# EAGLE design led_uhr (EAGLE 9.6.2)
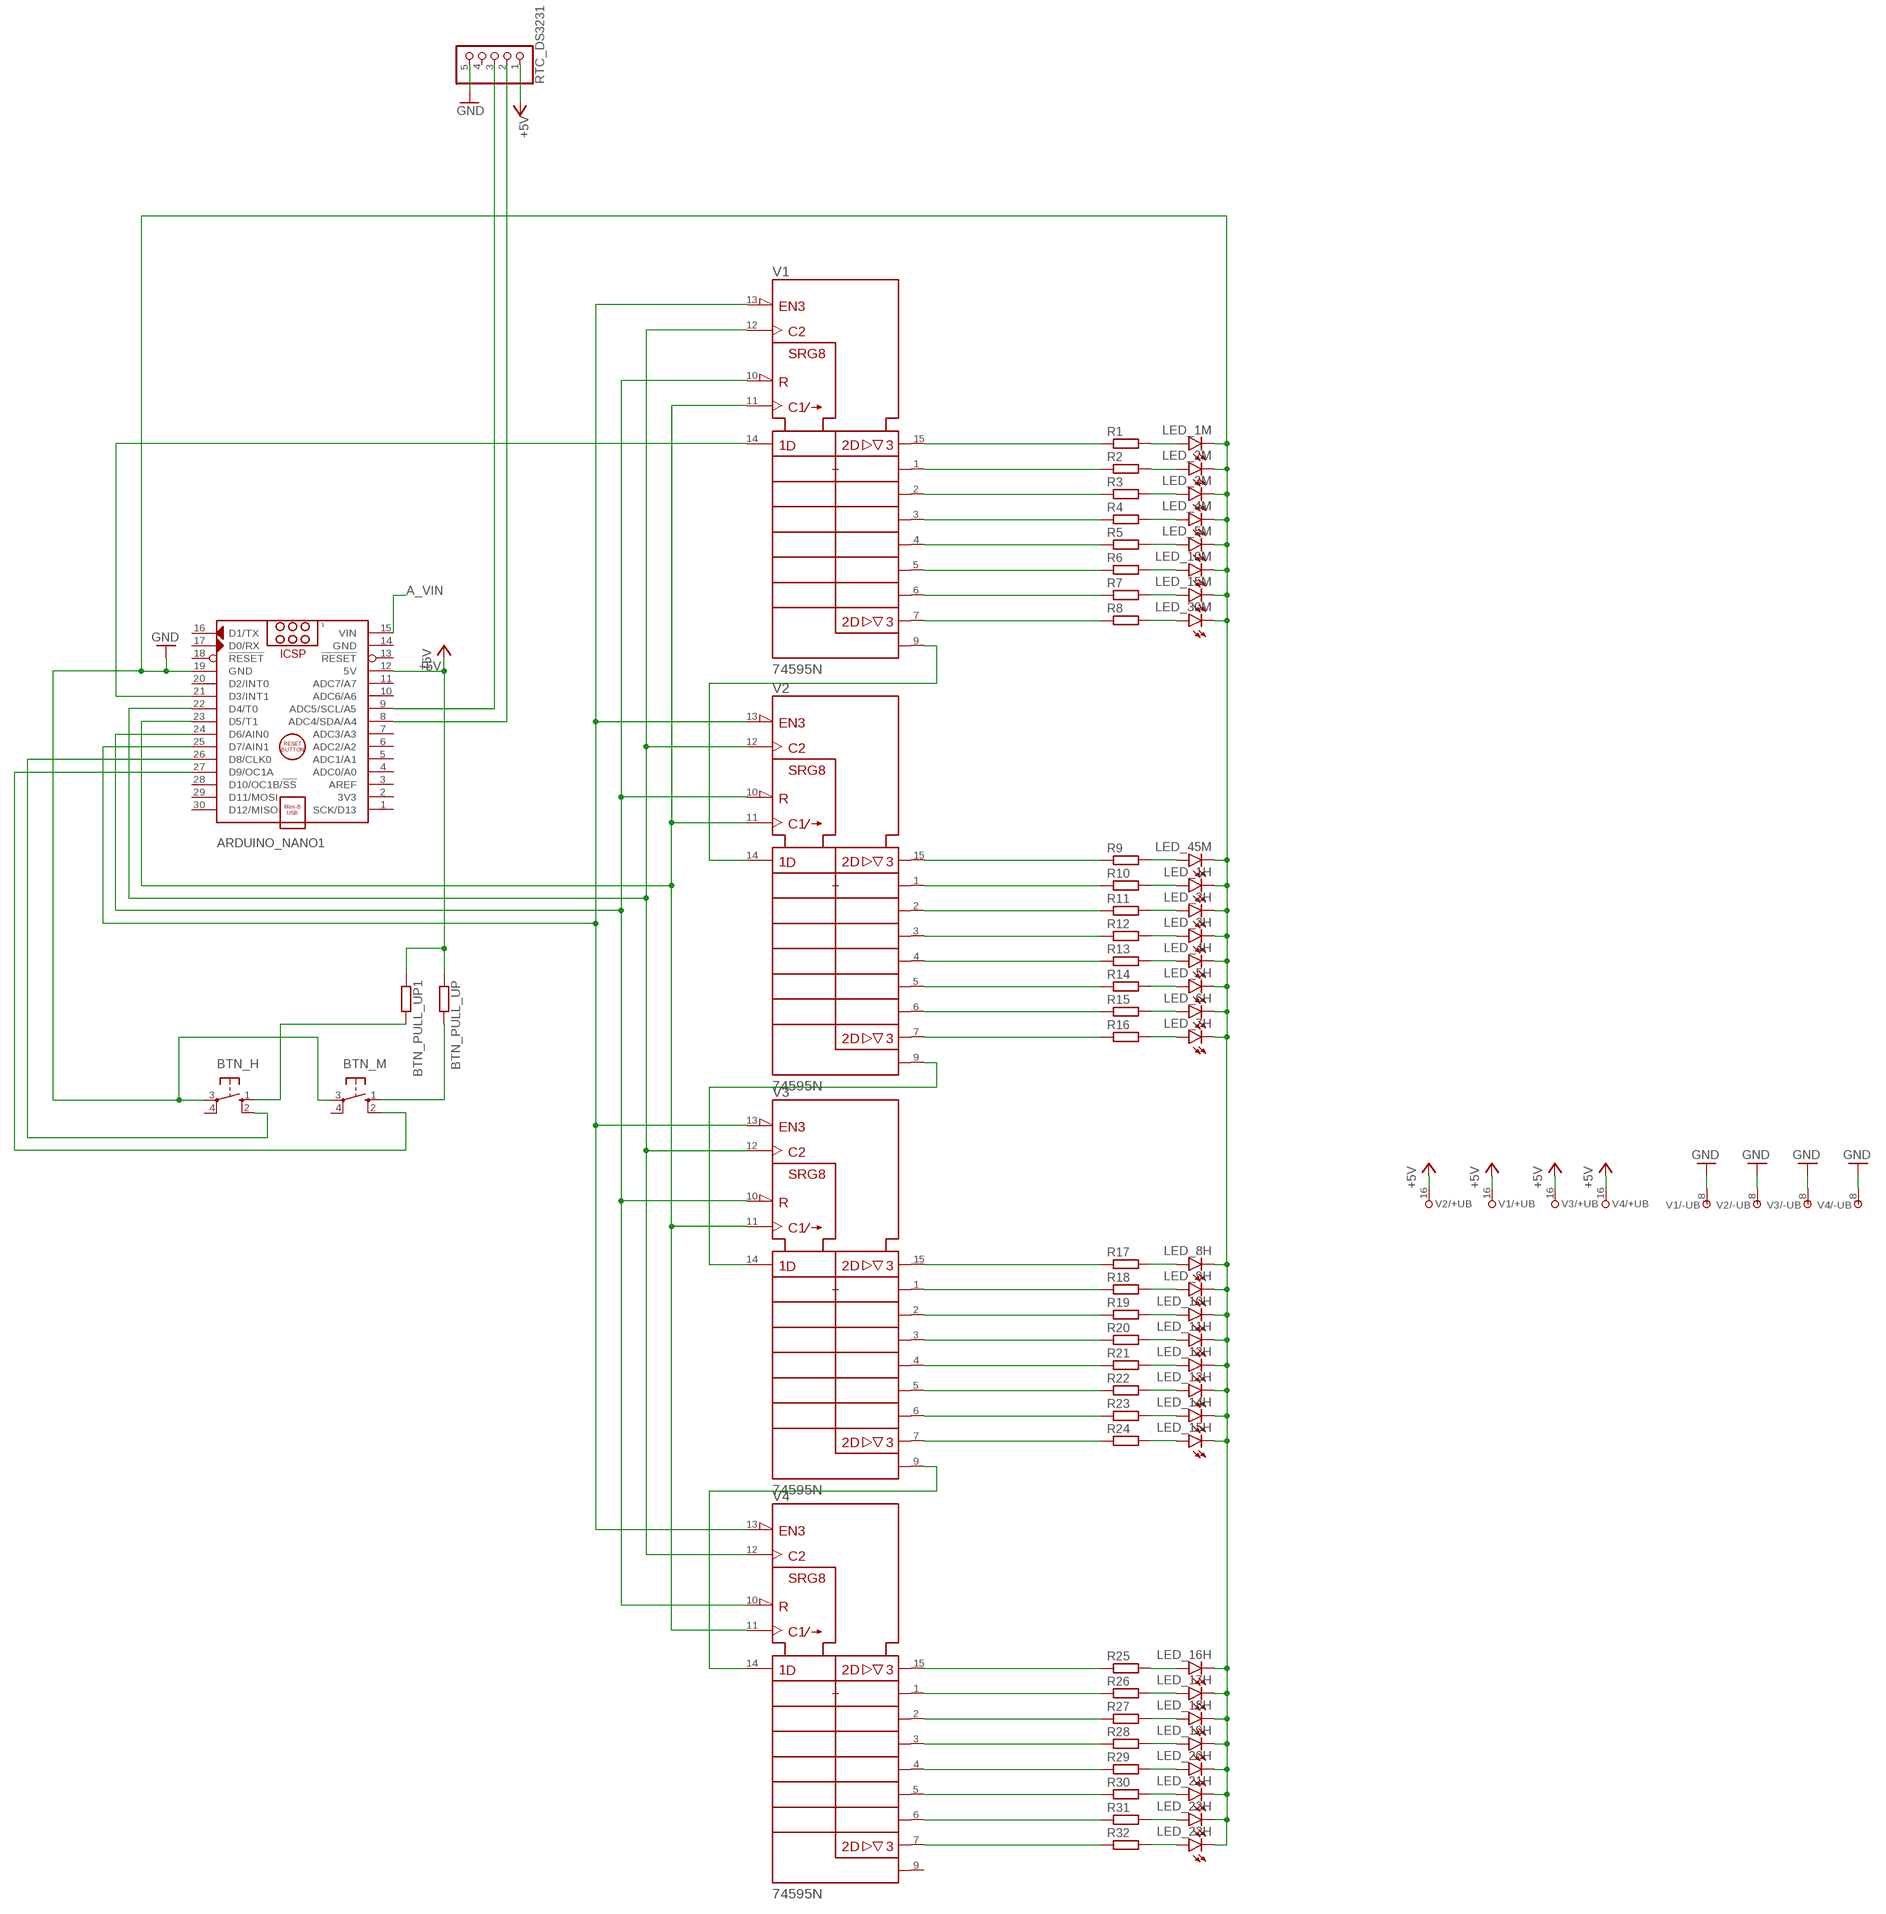
[diagram p0: schematic, sheet 1]

## Parts
ARDUINO_NANO1  ARDUINO_NANO  [ARDUINO_NANO]
BTN_H  40-XX  [B3F-40XX]
BTN_M  40-XX  [B3F-40XX]
BTN_PULL_UP  R-EU_0207/10  [0207/10]
BTN_PULL_UP1  R-EU_0207/10  [0207/10]
LED_1H  LED5MM  [LED5MM]
LED_1M  LED5MM  [LED5MM]
LED_2H  LED5MM  [LED5MM]
LED_2M  LED5MM  [LED5MM]
LED_3H  LED5MM  [LED5MM]
LED_3M  LED5MM  [LED5MM]
LED_4H  LED5MM  [LED5MM]
LED_4M  LED5MM  [LED5MM]
LED_5H  LED5MM  [LED5MM]
LED_5M  LED5MM  [LED5MM]
LED_6H  LED5MM  [LED5MM]
LED_7H  LED5MM  [LED5MM]
LED_8H  LED5MM  [LED5MM]
LED_9H  LED5MM  [LED5MM]
LED_10H  LED5MM  [LED5MM]
LED_10M  LED5MM  [LED5MM]
LED_11H  LED5MM  [LED5MM]
LED_12H  LED5MM  [LED5MM]
LED_13H  LED5MM  [LED5MM]
LED_14H  LED5MM  [LED5MM]
LED_15H  LED5MM  [LED5MM]
LED_15M  LED5MM  [LED5MM]
LED_16H  LED5MM  [LED5MM]
LED_17H  LED5MM  [LED5MM]
LED_18H  LED5MM  [LED5MM]
LED_19H  LED5MM  [LED5MM]
LED_20H  LED5MM  [LED5MM]
LED_21H  LED5MM  [LED5MM]
LED_22H  LED5MM  [LED5MM]
LED_23H  LED5MM  [LED5MM]
LED_30M  LED5MM  [LED5MM]
LED_45M  LED5MM  [LED5MM]
R1  R-EU_0207/10  [0207/10]
R2  R-EU_0207/10  [0207/10]
R3  R-EU_0207/10  [0207/10]
R4  R-EU_0207/10  [0207/10]
R5  R-EU_0207/10  [0207/10]
R6  R-EU_0207/10  [0207/10]
R7  R-EU_0207/10  [0207/10]
R8  R-EU_0207/10  [0207/10]
R9  R-EU_0207/10  [0207/10]
R10  R-EU_0207/10  [0207/10]
R11  R-EU_0207/10  [0207/10]
R12  R-EU_0207/10  [0207/10]
R13  R-EU_0207/10  [0207/10]
R14  R-EU_0207/10  [0207/10]
R15  R-EU_0207/10  [0207/10]
R16  R-EU_0207/10  [0207/10]
R17  R-EU_0207/10  [0207/10]
R18  R-EU_0207/10  [0207/10]
R19  R-EU_0207/10  [0207/10]
R20  R-EU_0207/10  [0207/10]
R21  R-EU_0207/10  [0207/10]
R22  R-EU_0207/10  [0207/10]
R23  R-EU_0207/10  [0207/10]
R24  R-EU_0207/10  [0207/10]
R25  R-EU_0207/10  [0207/10]
R26  R-EU_0207/10  [0207/10]
R27  R-EU_0207/10  [0207/10]
R28  R-EU_0207/10  [0207/10]
R29  R-EU_0207/10  [0207/10]
R30  R-EU_0207/10  [0207/10]
R31  R-EU_0207/10  [0207/10]
R32  R-EU_0207/10  [0207/10]
RTC_DS3231  PINHD-1X5  [1X05]
V1  74595N  [DIL16]
V2  74595N  [DIL16]
V3  74595N  [DIL16]
V4  74595N  [DIL16]

## Nets
+5V: ARDUINO_NANO1.12(5V) BTN_PULL_UP1.1 BTN_PULL_UP.1 RTC_DS3231.1 V1.16(+UB) V2.16(+UB) V3.16(+UB) V4.16(+UB)
A_VIN: ARDUINO_NANO1.15(VIN)
GND: ARDUINO_NANO1.19(GND) BTN_H.3(P) BTN_M.3(P) LED_1H.K(C) LED_1M.K(C) LED_2H.K(C) LED_2M.K(C) LED_3H.K(C) LED_3M.K(C) LED_4H.K(C) LED_4M.K(C) LED_5H.K(C) LED_5M.K(C) LED_6H.K(C) LED_7H.K(C) LED_8H.K(C) LED_9H.K(C) LED_10H.K(C) LED_10M.K(C) LED_11H.K(C) LED_12H.K(C) LED_13H.K(C) LED_14H.K(C) LED_15H.K(C) LED_15M.K(C) LED_16H.K(C) LED_17H.K(C) LED_18H.K(C) LED_19H.K(C) LED_20H.K(C) LED_21H.K(C) LED_22H.K(C) LED_23H.K(C) LED_30M.K(C) LED_45M.K(C) RTC_DS3231.5 V1.8(-UB) V2.8(-UB) V3.8(-UB) V4.8(-UB)
N$2: R1.1 V1.15(QA)
N$3: R2.1 V1.1(QB)
N$4: R3.1 V1.2(QC)
N$5: R4.1 V1.3(QD)
N$6: R5.1 V1.4(QE)
N$7: R6.1 V1.5(QF)
N$8: R7.1 V1.6(QG)
N$9: R8.1 V1.7(QH)
N$10: R10.1 V2.1(QB)
N$11: R9.1 V2.15(QA)
N$12: R11.1 V2.2(QC)
N$13: R12.1 V2.3(QD)
N$14: R13.1 V2.4(QE)
N$15: R14.1 V2.5(QF)
N$16: R15.1 V2.6(QG)
N$17: R16.1 V2.7(QH)
N$18: R17.1 V3.15(QA)
N$19: R18.1 V3.1(QB)
N$20: R19.1 V3.2(QC)
N$21: R20.1 V3.3(QD)
N$22: R21.1 V3.4(QE)
N$23: R22.1 V3.5(QF)
N$24: R23.1 V3.6(QG)
N$25: R24.1 V3.7(QH)
N$26: R25.1 V4.15(QA)
N$27: R26.1 V4.1(QB)
N$28: R27.1 V4.2(QC)
N$29: R28.1 V4.3(QD)
N$30: R29.1 V4.4(QE)
N$31: R30.1 V4.5(QF)
N$32: R31.1 V4.6(QG)
N$33: R32.1 V4.7(QH)
N$34: V1.9(QH*) V2.14(SER)
N$35: V2.9(QH*) V3.14(SER)
N$36: V3.9(QH*) V4.14(SER)
N$37: LED_1M.A R1.2
N$38: LED_2M.A R2.2
N$39: LED_3M.A R3.2
N$40: LED_4M.A R4.2
N$41: LED_5M.A R5.2
N$42: LED_10M.A R6.2
N$43: LED_15M.A R7.2
N$44: LED_30M.A R8.2
N$45: LED_45M.A R9.2
N$46: LED_1H.A R10.2
N$47: LED_2H.A R11.2
N$48: LED_3H.A R12.2
N$49: LED_4H.A R13.2
N$50: LED_5H.A R14.2
N$51: LED_6H.A R15.2
N$52: LED_7H.A R16.2
N$53: LED_8H.A R17.2
N$54: LED_9H.A R18.2
N$55: LED_10H.A R19.2
N$56: LED_11H.A R20.2
N$57: LED_12H.A R21.2
N$58: LED_13H.A R22.2
N$59: LED_14H.A R23.2
N$60: LED_15H.A R24.2
N$61: LED_16H.A R25.2
N$62: LED_17H.A R26.2
N$63: LED_18H.A R27.2
N$64: LED_19H.A R28.2
N$65: LED_20H.A R29.2
N$66: LED_21H.A R30.2
N$67: LED_22H.A R31.2
N$68: LED_23H.A R32.2
N$69: ARDUINO_NANO1.23(D5/T1) V1.11(SRCK) V2.11(SRCK) V3.11(SRCK) V4.11(SRCK)
N$70: ARDUINO_NANO1.24(D6/AIN0) V1.10(!SRCLR) V2.10(!SRCLR) V3.10(!SRCLR) V4.10(!SRCLR)
N$71: ARDUINO_NANO1.21(D3/INT1) V1.14(SER)
N$72: ARDUINO_NANO1.22(D4/T0) V1.12(RCK) V2.12(RCK) V3.12(RCK) V4.12(RCK)
N$73: ARDUINO_NANO1.25(D7/AIN1) V1.13(!G) V2.13(!G) V3.13(!G) V4.13(!G)
N$74: BTN_M.1(S) BTN_PULL_UP.2
N$75: ARDUINO_NANO1.27(D9/OC1A) BTN_M.2(S1)
N$77: ARDUINO_NANO1.9(ADC5/SCL/A5) RTC_DS3231.3
N$78: ARDUINO_NANO1.8(ADC4/SDA/A4) RTC_DS3231.2
N$80: ARDUINO_NANO1.26(D8/CLK0) BTN_H.2(S1)
N$81: BTN_H.1(S) BTN_PULL_UP1.2
Unconnected: ARDUINO_NANO1.1(SCK/D13) ARDUINO_NANO1.2(3V3) ARDUINO_NANO1.3(AREF) ARDUINO_NANO1.4(ADC0/A0) ARDUINO_NANO1.5(ADC1/A1) ARDUINO_NANO1.6(ADC2/A2) ARDUINO_NANO1.7(ADC3/A3) ARDUINO_NANO1.10(ADC6/A6) ARDUINO_NANO1.11(ADC7/A7) ARDUINO_NANO1.13(!RESET) ARDUINO_NANO1.16(D1/TX) ARDUINO_NANO1.17(D0/RX) ARDUINO_NANO1.18(!RESET) ARDUINO_NANO1.20(D2/INT0) ARDUINO_NANO1.28(D10/OC1B/!SS) ARDUINO_NANO1.29(D11/MOSI) ARDUINO_NANO1.30(D12/MISO) BTN_H.4(P1) BTN_M.4(P1) RTC_DS3231.4 V4.9(QH*)

## Power pins joined to a net without a drawn wire
GND: ARDUINO_NANO1.14(GND)

## Library data of the parts
ARDUINO_NANO1 = ArduinoNanoV30:ARDUINO_NANO: Arduino Nano V3.0 Module Overview: The Arduino Nano is a small, complete, and breadboard-friendly board based on the ATmega328 (Arduino Nano 3.x) or ATmega168 (Arduino Nano 2.x). It has more or less the same functionality of the Arduino Duemilanove, but in a different package. It lacks only a DC power jack, and works with a Mini-B USB cable instead of a standard one. The Nano was designed and is being produced by Gravitech <http://www.gravitech.us/arna30wiatp.html>. General specifications: Item Value Microcontroller Atmel ATmega168 or ATmega328 Operating Voltage (logic level) 5 V Input Voltage (recommended) 7-12 V Input Voltage (limits) 6-20 V Digital I/O Pins 14 (of which 6 provide PWM output) Analog Input Pins 8 DC Current per I/O Pin 40 mA Flash Memory 16 KB (ATmega168) or 32 KB (ATmega328) of which 2 KB used by bootloader SRAM 1 KB (ATmega168) or 2 KB (ATmega328) EEPROM 512 bytes (ATmega168) or 1 KB (ATmega328) Clock Speed 16 MHz Dimensions (Inches) 0.73" x 1.70" Dimensions (mm) 18mm x 45mm Overall height About 9 mm (not including pins) Weigth 5 g Power: The Arduino Nano can be powered via the Mini-B USB connection, 6-20V unregulated external power supply (pin 30), or 5V regulated external power supply (pin 27). The power source is automatically selected to the highest voltage source. Memory: The ATmega168 has 16 KB of flash memory for storing code (of which 2 KB is used for the bootloader); the ATmega328 has 32 KB, (also with 2 KB used for the bootloader). The ATmega168 has 1 KB of SRAM and 512 bytes of EEPROM (which can be read and written with the EEPROM library); the ATmega328 has 2 KB of SRAM and 1 KB of EEPROM. Input and Output: Each of the 14 digital pins on the Nano can be used as an input or output, using pinMode(), digitalWrite(), and digitalRead() functions. They operate at 5 volts. Each pin can provide or receive a maximum of 40 mA and has an internal pull-up resistor (disconnected by default) of 20-50 kOhms. In addition, some pins have specialized functions. Visit Arduino - ArduinoBoardNano <https://www.arduino.cc/en/Main/ArduinoBoardNano>
BTN_H BTN_M = switch-omron:40-XX: OMRON SWITCH; MF: OMRON COMPONENTS USA; MPN: B3F-4000; OC_FARNELL: 176434; OC_NEWARK: 36K3105
BTN_PULL_UP BTN_PULL_UP1 R1-R32 = rcl:R-EU_: RESISTOR, European symbol; SPICEPREFIX: R
LED_1H LED_1M LED_2H LED_2M LED_3H LED_3M LED_4H LED_4M LED_5H LED_5M LED_6H LED_7H LED_8H LED_9H LED_10H LED_10M LED_11H LED_12H LED_13H LED_14H LED_15H LED_15M LED_16H LED_17H LED_18H LED_19H LED_20H LED_21H LED_22H LED_23H LED_30M LED_45M = led:LED: LED OSRAM: - CHIPLED LG R971, LG N971, LY N971, LG Q971, LY Q971, LO R971, LY R971 LH N974, LH R974 LS Q976, LO Q976, LY Q976 LO Q996 - Hyper CHIPLED LW Q18S LB Q993, LB Q99A, LB R99A - SideLED LS A670, LO A670, LY A670, LG A670, LP A670 LB A673, LV A673, LT A673, LW A673 LH A674 LY A675 LS A676, LA A676, LO A676, LY A676, LW A676 LS A679, LY A679, LG A679 - Hyper Micro SIDELED® LS Y876, LA Y876, LO Y876, LY Y876 LT Y87S - SmartLED LW L88C, LW L88S LB L89C, LB L89S, LG L890 LS L89K, LO L89K, LY L89K LS L896, LA L896, LO L896, LY L896 - TOPLED LS T670, LO T670, LY T670, LG T670, LP T670 LSG T670, LSP T670, LSY T670, LOP T670, LYG T670 LG T671, LOG T671, LSG T671 LB T673, LV T673, LT T673, LW T673 LH T674 LS T676, LA T676, LO T676, LY T676, LB T676, LH T676, LSB T676, LW T676 LB T67C, LV T67C, LT T67C, LS T67K, LO T67K, LY T67K, LW E67C LS E67B, LA E67B, LO E67B, LY E67B, LB E67C, LV E67C, LT E67C LW T67C LS T679, LY T679, LG T679 LS T770, LO T770, LY T770, LG T770, LP T770 LB T773, LV T773, LT T773, LW T773 LH T774 LS E675, LA E675, LY E675, LS T675 LS T776, LA T776, LO T776, LY T776, LB T776 LHGB T686 LT T68C, LB T68C - Hyper Mini TOPLED® LB M676 - Mini TOPLED Santana® LG M470 LS M47K, LO M47K, LY M47K Source: http://www.osram.convergy.de LUXEON: - LUMILED® LXK2-PW12-R00, LXK2-PW12-S00, LXK2-PW14-U00, LXK2-PW14-V00 LXK2-PM12-R00, LXK2-PM12-S00, LXK2-PM14-U00 LXK2-PE12-Q00, LXK2-PE12-R00, LXK2-PE12-S00, LXK2-PE14-T00, LXK2-PE14-U00 LXK2-PB12-K00, LXK2-PB12-L00, LXK2-PB12-M00, LXK2-PB14-N00, LXK2-PB14-P00, LXK2-PB14-Q00 LXK2-PR12-L00, LXK2-PR12-M00, LXK2-PR14-Q00, LXK2-PR14-R00 LXK2-PD12-Q00, LXK2-PD12-R00, LXK2-PD12-S00 LXK2-PH12-R00, LXK2-PH12-S00 LXK2-PL12-P00, LXK2-PL12-Q00, LXK2-PL12-R00 Source: www.luxeon.com KINGBRIGHT: KA-3528ASYC Source: www.kingbright.com
RTC_DS3231 = pinhead:PINHD-1X5: PIN HEADER
V1-V4 = 74ttl-din:74*595: 8-bit SHIFT REGISTER, output latch

## Board
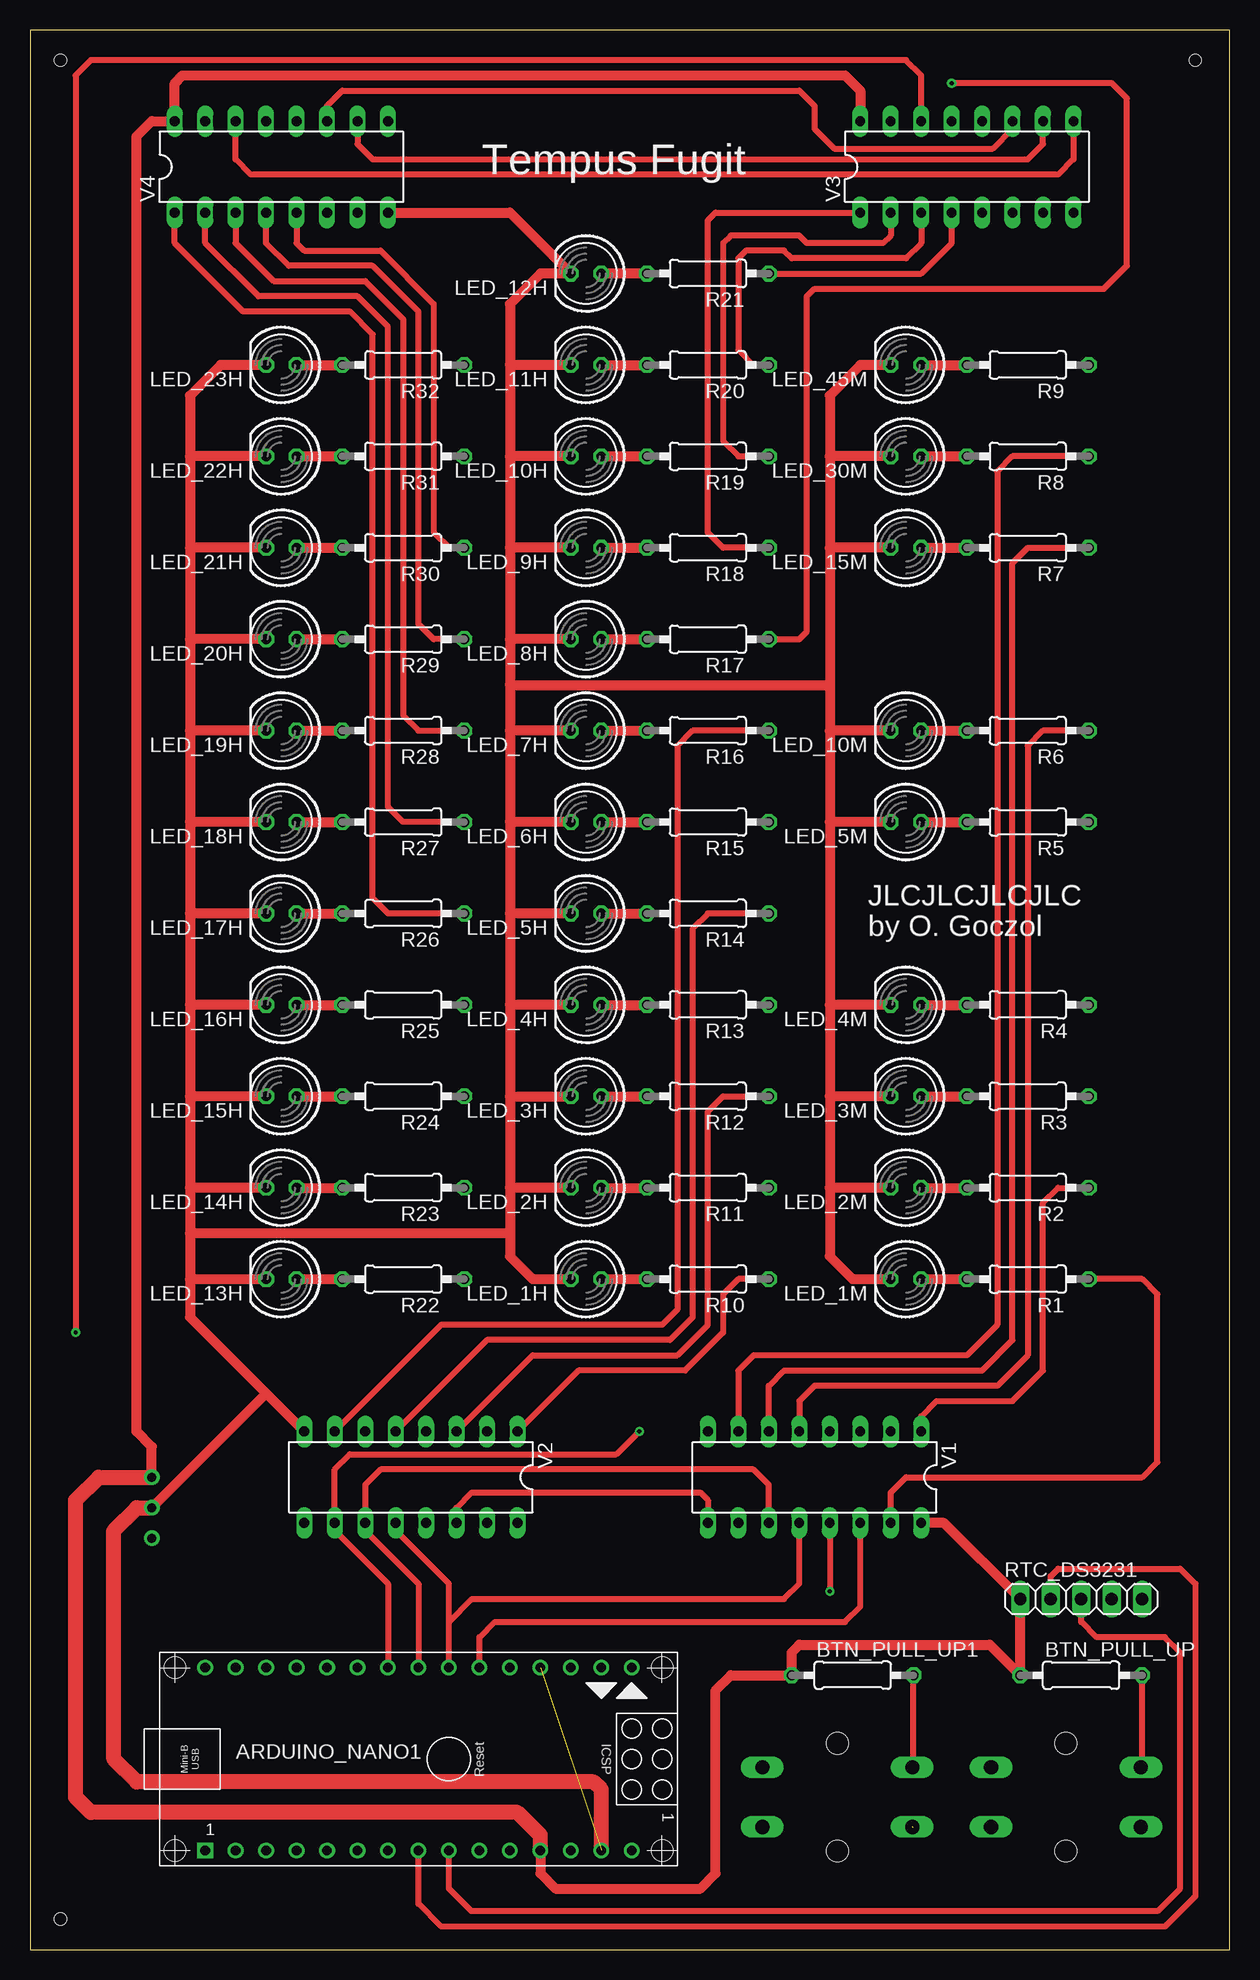
[diagram p1: board, top side]
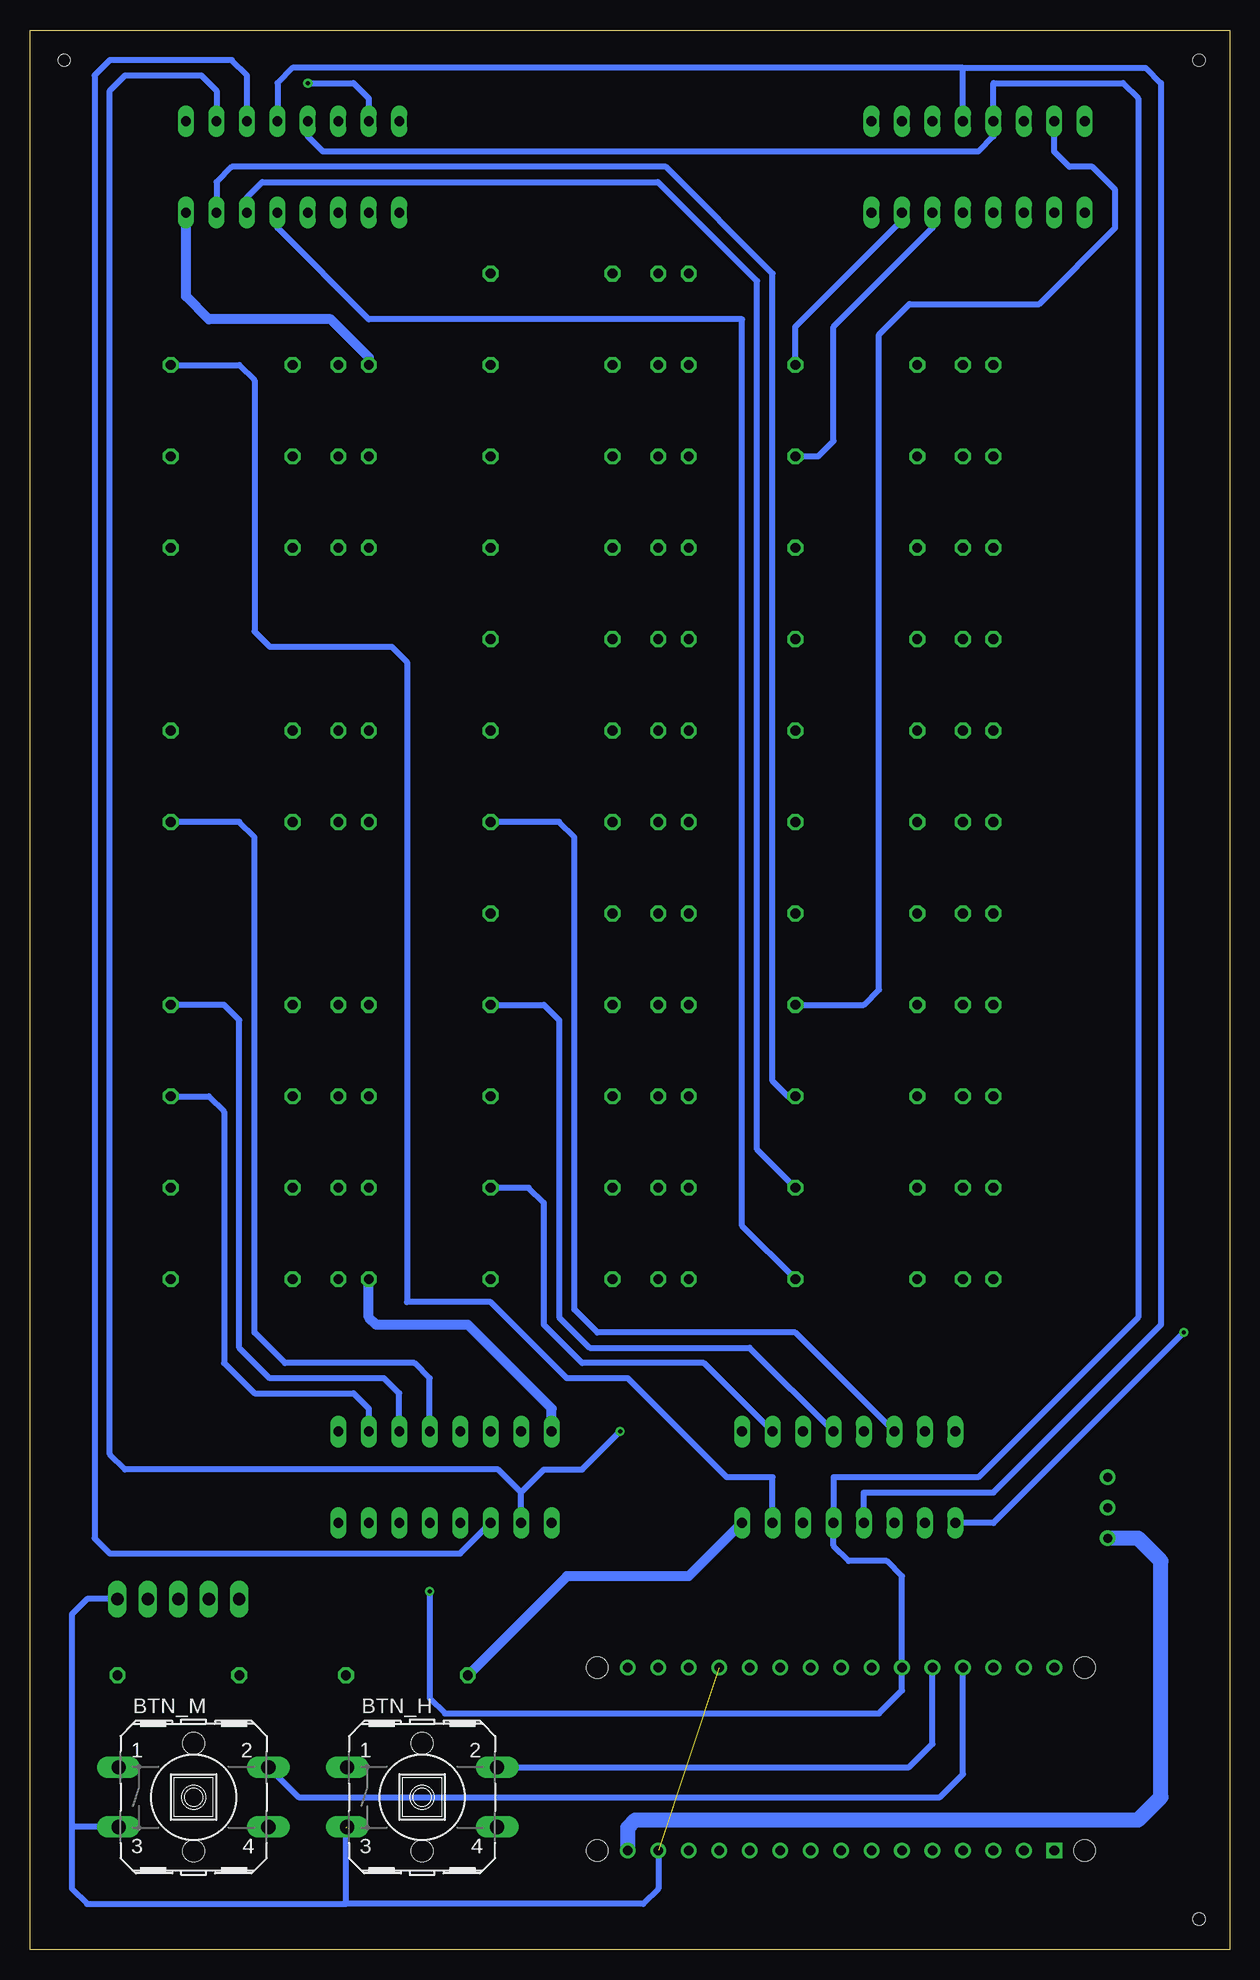
[diagram p2: board, bottom side, seen from below]

Size 100 x 160 mm. Coordinates in mm from the lower left corner, seen from the top.
Outline: 0,0 100,0 100,160 0,160 0,0
Copper layers (1*16): Top 0.035mm / dielectric 1.5mm / Bottom 0.035mm
Design rules "default": minimum track width 6mil, minimum drill 0.35mm, track to track 6mil, track to pad 6mil, pad to pad 6mil, via to via 6mil, smd to smd 6mil, copper to edge 40mil, drill to drill 6mil, minimum pad ring 10mil, minimum via ring 8mil, stop-mask expansion 4mil, vias tented up to drill 0mil, thermal gap 10mil
Holes 1 mm at 2.54,157.48 2.54,2.54 97.16,157.48

### Footprints (pad centres in the part's own frame; a part is rotated, then mirrored left to right if it is on the bottom)
ARDUINO_NANO = drill 0.8 square: 1 -20.32,-7.62 | drill 0.8: 2 -17.78,-7.62; 3 -15.24,-7.62; 4 -12.7,-7.62; 5 -10.16,-7.62; 6 -7.62,-7.62; 7 -5.08,-7.62; 8 -2.54,-7.62; 9 0,-7.62; 10 2.54,-7.62; 11 5.08,-7.62; 12 7.62,-7.62; 13 10.16,-7.62; 14 12.7,-7.62; 15 15.24,-7.62; 16 15.24,7.62; 17 12.7,7.62; 18 10.16,7.62; 19 7.62,7.62; 20 5.08,7.62; 21 2.54,7.62; 22 0,7.62; 23 -2.54,7.62; 24 -5.08,7.62; 25 -7.62,7.62; 26 -10.16,7.62; 27 -12.7,7.62; 28 -15.24,7.62; 29 -17.78,7.62; 30 -20.32,7.62 | hole 1.778: -22.86,-7.62; -22.86,7.62; 17.78,7.62; 17.78,-7.62
B3F-40XX = drill 1.194 long: 1 -6.248,2.489; 2 6.248,2.489; 3 -6.248,-2.489; 4 6.248,-2.489 | hole 1.803: 0,-4.496; 0,4.496
0207/10 = drill 0.813 octagon: 1 -5.08,0; 2 5.08,0
LED5MM = drill 0.813 octagon: A -1.27,0; K 1.27,0
1X05 = drill 1.016 long: 1 -5.08,0; 2 -2.54,0; 3 0,0; 4 2.54,0; 5 5.08,0
DIL16 = drill 0.813 long: 1 -8.89,-3.81; 2 -6.35,-3.81; 3 -3.81,-3.81; 4 -1.27,-3.81; 5 1.27,-3.81; 6 3.81,-3.81; 7 6.35,-3.81; 8 8.89,-3.81; 9 8.89,3.81; 10 6.35,3.81; 11 3.81,3.81; 12 1.27,3.81; 13 -1.27,3.81; 14 -3.81,3.81; 15 -6.35,3.81; 16 -8.89,3.81

### Placement (x,y rotation side)
ARDUINO_NANO1  34.92,15.88 0 top
BTN_H  67.31,12.7 0 bottom
BTN_M  86.36,12.7 0 bottom
BTN_PULL_UP  87.63,22.86 0 top
BTN_PULL_UP1  68.58,22.86 0 top
LED_1H  46.35,55.88 180 top
LED_1M  73.03,55.88 180 top
LED_2H  46.35,63.5 180 top
LED_2M  73.03,63.5 180 top
LED_3H  46.35,71.12 180 top
LED_3M  73.03,71.12 180 top
LED_4H  46.35,78.74 180 top
LED_4M  73.03,78.74 180 top
LED_5H  46.35,86.36 180 top
LED_5M  73.03,93.98 180 top
LED_6H  46.35,93.98 180 top
LED_7H  46.35,101.6 180 top
LED_8H  46.35,109.22 180 top
LED_9H  46.35,116.84 180 top
LED_10H  46.35,124.46 180 top
LED_10M  73.03,101.6 180 top
LED_11H  46.35,132.08 180 top
LED_12H  46.35,139.7 180 top
LED_13H  20.95,55.88 180 top
LED_14H  20.95,63.5 180 top
LED_15H  20.95,71.12 180 top
LED_15M  73.03,116.84 180 top
LED_16H  20.95,78.74 180 top
LED_17H  20.95,86.36 180 top
LED_18H  20.95,93.98 180 top
LED_19H  20.95,101.6 180 top
LED_20H  20.95,109.22 180 top
LED_21H  20.95,116.84 180 top
LED_22H  20.95,124.46 180 top
LED_23H  20.95,132.08 180 top
LED_30M  73.03,124.46 180 top
LED_45M  73.03,132.08 180 top
R1  83.19,55.88 180 top
R2  83.19,63.5 180 top
R3  83.19,71.12 180 top
R4  83.19,78.74 180 top
R5  83.19,93.98 180 top
R6  83.19,101.6 180 top
R7  83.19,116.84 180 top
R8  83.19,124.46 180 top
R9  83.19,132.08 180 top
R10  56.52,55.88 180 top
R11  56.52,63.5 180 top
R12  56.52,71.12 180 top
R13  56.52,78.74 180 top
R14  56.52,86.36 180 top
R15  56.52,93.98 180 top
R16  56.52,101.6 180 top
R17  56.52,109.22 180 top
R18  56.52,116.84 180 top
R19  56.52,124.46 180 top
R20  56.52,132.08 180 top
R21  56.52,139.7 180 top
R22  31.11,55.88 180 top
R23  31.11,63.5 180 top
R24  31.11,71.12 180 top
R25  31.11,78.74 180 top
R26  31.11,86.36 180 top
R27  31.11,93.98 180 top
R28  31.11,101.6 180 top
R29  31.11,109.22 180 top
R30  31.11,116.84 180 top
R31  31.11,124.46 180 top
R32  31.11,132.08 180 top
RTC_DS3231  87.63,29.21 0 top
V1  65.41,39.37 180 top
V2  31.75,39.37 180 top
V3  78.11,148.59 0 top
V4  20.95,148.59 0 top

### Tracks (layer width: path | path; a pad name or v marks a point on that pad's centre or on a via)
+5V  (via drill 0.75 pad 1.3)
  Top 0.813: V3.16 69.22,154.94 67.94,156.21 12.7,156.21 12.06,155.57 V4.16 10.16,152.4 8.89,151.13 8.89,43.18 10.16,41.91 v10.16,39.37 | ARDUINO_NANO1.12 42.55,6.35 43.81,5.08 55.88,5.08 57.15,6.35 57.15,21.59 58.42,22.86 BTN_PULL_UP1.1 63.5,24.77 64.14,25.4 80.01,25.4 BTN_PULL_UP.1 RTC_DS3231.1 76.2,35.56 V1.16
  Top 1.27: ARDUINO_NANO1.12 42.55,9.53 40.64,11.43 5.08,11.43 3.81,12.7 3.81,37.47 5.71,39.37 v10.16,39.37
  Bottom 0.813: V2.16 45.09,31.11 55.24,31.11 BTN_PULL_UP1.1
A_VIN  (via drill 0.75 pad 1.3)
  Bottom 1.27: ARDUINO_NANO1.15 50.16,10.16 49.53,10.79 7.62,10.79 5.71,12.7 5.71,32.38 7.62,34.29 v10.16,34.29
GND  (via drill 0.75 pad 1.3)  (2 unrouted)
  Top 0.813: LED_23H.K 15.88,132.08 13.34,129.54 13.34,124.46 | 13.34,124.46 13.34,116.84 | 13.34,116.84 13.34,109.22 | 13.34,109.22 13.34,101.6 | 13.34,101.6 13.34,93.98 | 13.34,93.98 13.34,86.36 | 13.34,86.36 13.34,78.74 | 13.34,78.74 13.34,71.12 | 13.34,71.12 13.34,63.5 | 13.34,63.5 13.34,59.69 | 13.34,59.69 13.34,55.88 | 13.34,55.88 LED_13H.K | LED_14H.K 13.34,63.5 | LED_15H.K 13.34,71.12 | LED_16H.K 13.34,78.74 | LED_17H.K 13.34,86.36 | LED_18H.K 13.34,93.98 | LED_19H.K 13.34,101.6 | LED_20H.K 13.34,109.22 | LED_21H.K 13.34,116.84 | LED_22H.K 13.34,124.46 | 40.01,132.08 40.01,137.16 42.55,139.7 LED_12H.K 40.01,144.78 V4.8 | 40.01,132.08 40.01,124.46 | 40.01,124.46 40.01,116.84 | 40.01,116.84 40.01,109.22 | 40.01,109.22 40.01,105.41 | 40.01,105.41 40.01,101.6 | 40.01,101.6 40.01,93.98 | 40.01,93.98 40.01,86.36 | 40.01,86.36 40.01,78.74 | 40.01,78.74 40.01,71.12 | 40.01,71.12 40.01,63.5 | 40.01,63.5 40.01,59.69 | 40.01,59.69 40.01,57.78 41.91,55.88 LED_1H.K | LED_2H.K 40.01,63.5 | 40.01,71.12 LED_3H.K | LED_4H.K 40.01,78.74 | LED_5H.K 40.01,86.36 | LED_6H.K 40.01,93.98 | LED_7H.K 40.01,101.6 | LED_8H.K 40.01,109.22 | LED_9H.K 40.01,116.84 | LED_10H.K 40.01,124.46 | LED_11H.K 40.01,132.08 | LED_45M.K 69.22,132.08 66.67,129.54 66.67,124.46 | 66.67,124.46 66.67,116.84 | 66.67,116.84 66.67,105.41 | 66.67,105.41 66.67,101.6 | 66.67,101.6 66.67,93.98 | 66.67,93.98 66.67,78.74 | 66.67,78.74 66.67,71.12 | 66.67,71.12 66.67,63.5 | 66.67,63.5 66.67,57.78 68.58,55.88 LED_1M.K | LED_2M.K 66.67,63.5 | LED_3M.K 66.67,71.12 | LED_4M.K 66.67,78.74 | LED_5M.K 66.67,93.98 | LED_10M.K 66.67,101.6 | LED_15M.K 66.67,116.84 | LED_30M.K 66.67,124.46 | 13.34,55.88 13.34,52.7 19.68,46.35
  Top 0.813: 19.68,46.35 V2.8 | 40.01,59.69 13.34,59.69 | 40.01,105.41 66.67,105.41 | v10.16,36.83 19.68,46.35
  Top 1.27: ARDUINO_NANO1.14 47.62,13.34 46.99,13.97 8.89,13.97 6.99,15.88 6.99,34.92 8.89,36.83 v10.16,36.83
  Bottom 0.508: ARDUINO_NANO1.14 47.62,5.08 48.9,3.81 73.66,3.81 | 73.66,3.81 73.66,10.16 | 92.71,10.11 BTN_M.3 96.47,10.21 96.52,10.16 | RTC_DS3231.5 95.25,29.21 96.52,27.94 96.52,10.16 | 96.52,10.16 96.52,5.08 95.25,3.81 73.66,3.81
  Bottom 0.813: V1.8 56.52,45.09 63.5,52.07 71.12,52.07 71.75,52.7 LED_1M.K | LED_45M.K 71.75,132.72 74.93,135.89 85.09,135.89 87,137.79 V3.8
N$2
  Top 0.508: V1.15 71.75,38.1 73.03,39.37 92.71,39.37 93.98,40.64 93.98,54.61 92.71,55.88 R1.1
N$3
  Top 0.508: V1.1 74.3,44.45 75.56,45.72 81.92,45.72 84.45,48.26 84.45,62.23 85.72,63.5 R2.1
N$4
  Bottom 0.508: R3.1 85.09,71.12 83.82,69.85 83.82,48.9 81.28,46.35 73.03,46.35 71.75,45.09 V1.2
N$5
  Bottom 0.508: V1.3 69.22,46.35 70.48,47.62 80.01,47.62 82.55,50.16 82.55,77.47 83.82,78.74 R4.1
N$6
  Bottom 0.508: V1.4 66.67,47.62 67.94,48.9 78.74,48.9 81.28,51.44 81.28,92.71 82.55,93.98 R5.1
N$7
  Top 0.508: R6.1 84.45,101.6 83.19,100.33 83.19,49.53 80.64,46.99 65.41,46.99 64.14,45.72 V1.5
N$8
  Top 0.508: V1.6 61.59,46.99 62.87,48.26 79.38,48.26 81.92,50.8 81.92,115.57 83.19,116.84 R7.1
N$9
  Top 0.508: R8.1 81.92,124.46 80.64,123.19 80.64,52.07 78.11,49.53 60.33,49.53 59.05,48.26 V1.7
N$10
  Top 0.508: R10.1 59.05,55.88 57.78,54.61 57.78,51.44 54.61,48.26 45.72,48.26 V2.1
N$11
  Bottom 0.508: R9.1 82.55,132.08 81.28,130.81 81.28,109.86 80.01,108.58 69.85,108.58 68.58,107.31 68.58,53.98 61.59,53.98 58.42,50.8 55.24,47.62 50.16,47.62 41.91,39.37 38.1,39.37 V2.15
N$12
  Bottom 0.508: R11.1 58.42,63.5 57.15,62.23 57.15,52.07 53.98,48.9 43.81,48.9 V2.2
N$13
  Top 0.508: R12.1 57.78,71.12 56.52,69.85 56.52,52.07 53.98,49.53 41.91,49.53 V2.3
N$14
  Bottom 0.508: R13.1 57.15,78.74 55.88,77.47 55.88,52.7 53.34,50.16 40.01,50.16 V2.4
N$15
  Top 0.508: R14.1 56.52,86.36 55.24,85.09 55.24,52.7 53.34,50.8 38.1,50.8 V2.5
N$16
  Bottom 0.508: R15.1 55.88,93.98 54.61,92.71 54.61,53.34 52.7,51.44 36.2,51.44 V2.6
N$17
  Top 0.508: R16.1 55.24,101.6 53.98,100.33 53.98,53.34 52.7,52.07 34.29,52.07 V2.7
N$18  (via drill 0.35)
  Top 0.508: R17.1 64.14,109.22 64.77,109.86 64.77,137.79 65.41,138.43 89.53,138.43 91.44,140.34 91.44,154.31 90.17,155.57 v76.83,155.57
  Bottom 0.508: v76.83,155.57 73.03,155.57 71.75,154.31 V3.15
N$19
  Top 0.508: R18.1 57.78,116.84 56.52,118.11 56.52,144.15 57.15,144.78 V3.1
N$20
  Top 0.508: V3.2 71.75,142.88 71.12,142.24 64.77,142.24 64.14,142.88 58.42,142.88 57.78,142.24 57.78,125.73 59.05,124.46 R19.1
N$21
  Top 0.508: V3.3 74.3,142.24 73.03,140.97 63.5,140.97 62.87,141.6 59.69,141.6 59.05,140.97 59.05,133.35 60.33,132.08 R20.1
N$22
  Top 0.508: R21.1 74.3,139.7 76.83,142.24 V3.4
N$23
  Bottom 0.508: R22.1 40.64,60.33 40.64,135.89 71.75,135.89 79.38,143.51 V3.5
N$24
  Bottom 0.508: R23.1 39.4,66.7 39.4,139.06 47.65,147.32 80.64,147.32 81.92,146.05 V3.6
N$25
  Bottom 0.508: R24.1 36.83,71.12 38.1,72.39 38.1,139.7 46.99,148.59 83.19,148.59 84.45,147.32 V3.7
N$26
  Bottom 0.508: R25.1 30.48,78.74 29.21,80.01 29.21,134.62 26.67,137.16 15.88,137.16 9.53,143.51 9.53,146.69 11.43,148.59 13.34,148.59 14.61,149.86 V4.15
N$27
  Top 0.508: R26.1 29.84,86.36 28.57,87.63 28.57,134.62 26.67,136.53 17.78,136.53 12.06,142.24 V4.1
N$28
  Top 0.508: R27.1 31.11,93.98 29.84,95.25 29.84,135.25 27.3,137.79 19.05,137.79 14.61,142.24 V4.2
N$29
  Top 0.508: R28.1 32.38,101.6 31.11,102.87 31.11,135.89 27.94,139.06 20.32,139.06 17.14,142.24 V4.3
N$30
  Top 0.508: R29.1 33.66,109.22 32.38,110.49 32.38,136.53 28.57,140.34 21.59,140.34 19.68,142.24 V4.4
N$31
  Top 0.508: R30.1 34.92,116.84 33.66,118.11 33.66,137.16 29.21,141.6 22.86,141.6 22.23,142.24 V4.5
N$32
  Bottom 0.508: R31.1 34.29,124.46 33.02,125.73 33.02,135.25 24.77,143.51 V4.6
N$33
  Bottom 0.508: R32.1 36.2,135.25 27.3,144.15 V4.7
N$34
  Top 0.508: V2.14 35.56,36.83 36.83,38.1 55.88,38.1 56.52,37.47 V1.9
N$35  (via drill 0.35)
  Top 0.508: V3.14 74.3,156.21 73.03,157.48 5.08,157.48 3.81,156.21 v3.81,51.44
  Bottom 0.508: V2.9 19.68,35.56 v3.81,51.44
N$36
  Top 0.508: V3.9 87,149.22 85.72,147.96 18.41,147.96 17.14,149.22 V4.14
N$37
  Top 0.813: LED_1M.A R1.2
N$38
  Top 0.813: LED_2M.A R2.2
N$39
  Top 0.813: LED_3M.A R3.2
N$40
  Top 0.813: LED_4M.A R4.2
N$41
  Top 0.813: LED_5M.A R5.2
N$42
  Top 0.813: LED_10M.A R6.2
N$43
  Top 0.813: LED_15M.A R7.2
N$44
  Top 0.813: LED_30M.A R8.2
N$45
  Top 0.813: LED_45M.A R9.2
N$46
  Top 0.813: LED_1H.A R10.2
N$47
  Top 0.813: LED_2H.A R11.2
N$48
  Top 0.813: LED_3H.A R12.2
N$49
  Top 0.813: LED_4H.A R13.2
N$50
  Top 0.813: LED_5H.A R14.2
N$51
  Top 0.813: LED_6H.A R15.2
N$52
  Top 0.813: LED_7H.A R16.2
N$53
  Top 0.813: LED_8H.A R17.2
N$54
  Top 0.813: LED_9H.A R18.2
N$55
  Top 0.813: LED_10H.A R19.2
N$56
  Top 0.813: LED_11H.A R20.2
N$57
  Top 0.813: R21.2 LED_12H.A
N$58
  Top 0.813: LED_13H.A R22.2
N$59
  Top 0.813: LED_14H.A R23.2
N$60
  Top 0.813: LED_15H.A R24.2
N$61
  Top 0.813: LED_16H.A R25.2
N$62
  Top 0.813: LED_17H.A R26.2
N$63
  Top 0.813: LED_18H.A R27.2
N$64
  Top 0.813: LED_19H.A R28.2
N$65
  Top 0.813: LED_20H.A R29.2
N$66
  Top 0.813: LED_21H.A R30.2
N$67
  Top 0.813: LED_22H.A R31.2
N$68
  Top 0.813: LED_23H.A R32.2
N$69
  Top 0.508: V4.11 24.77,153.67 26.04,154.94 64.14,154.94 65.41,153.67 65.41,151.76 67.06,150.11 80.26,150.11 81.92,151.76 V3.11 | ARDUINO_NANO1.23 32.38,30.48 27.94,34.92 V2.11 27.94,38.73 29.21,40.01 60.33,40.01 61.59,38.73 V1.11
  Bottom 0.508: V3.11 81.92,156.21 83.19,157.48 93.34,157.48 94.61,156.21 94.61,34.29 93.34,33.02 64.14,33.02 V1.11
N$70  (via drill 0.35)
  Top 0.508: V4.10 27.3,150.5 28.57,149.22 83.19,149.22 84.45,150.5 V3.10 | ARDUINO_NANO1.24 29.84,30.48 25.4,34.92 V2.10 25.4,40.01 26.67,41.27 48.9,41.27 v50.8,43.18
  Bottom 0.508: V3.10 84.45,154.94 85.72,156.21 92.08,156.21 93.34,154.94 93.34,41.27 92.08,40.01 60.96,40.01 59.05,38.1 | V1.10 59.05,38.1 | 59.05,38.1 57.15,40.01 53.98,40.01 v50.8,43.18
N$71
  Top 0.508: ARDUINO_NANO1.21 37.47,26.04 38.73,27.3 67.94,27.3 69.22,28.57 V1.14
N$72
  Top 0.508: ARDUINO_NANO1.22 34.92,27.3 | 34.92,27.3 34.92,30.48 30.48,34.92 V2.12 | V1.12 64.14,30.48 62.87,29.21 36.83,29.21 34.92,27.3
  Bottom 0.508: 22.23,156.84 78.11,156.84 79.38,155.57 V3.12 | V4.12 22.23,156.84 | 22.23,156.84 6.99,156.84 5.71,155.57 5.71,52.07 19.68,38.1 30.48,38.1 V2.12
N$73  (via drill 0.35)
  Top 0.508: V1.13 v66.67,29.84
  Bottom 0.508: V3.13 76.83,151.13 75.56,149.86 20.95,149.86 19.68,151.13 V4.13 19.68,155.57 8.89,155.57 7.62,154.31 7.62,52.7 20.95,39.37 33.02,39.37 V2.13 33.02,33.66 31.75,32.38 28.57,32.38 27.3,31.11 ARDUINO_NANO1.25 27.3,21.59 29.21,19.68 65.41,19.68 66.67,20.95 v66.67,29.84
N$74
  Top 0.508: BTN_M.1 92.71,15.29 BTN_PULL_UP.2
N$75
  Bottom 0.508: BTN_M.2 77.62,12.7 24.13,12.7 22.23,14.61 ARDUINO_NANO1.27
N$77
  Top 0.508: 87.63,27.94 RTC_DS3231.3 87.63,27.3 88.9,26.04 94.61,26.04 95.89,24.77 95.89,5.08 94,3.2 36.8,3.2 34.92,5.08 ARDUINO_NANO1.9
N$78
  Top 0.508: RTC_DS3231.2 85.09,31.11 85.72,31.75 95.89,31.75 97.16,30.48 97.16,4.45 94.61,1.91 34.29,1.91 32.38,3.81 ARDUINO_NANO1.8
N$80
  Bottom 0.508: BTN_H.2 26.72,15.19 24.77,17.14 ARDUINO_NANO1.26
N$81
  Top 0.508: BTN_H.1 73.66,15.29 BTN_PULL_UP1.2

### Text on the board
tPlace: Tempus Fugit | JLCJLCJLCJLC | by O. Goczol